# EAGLE design Photoresistor ADC (EAGLE 9.5.2)
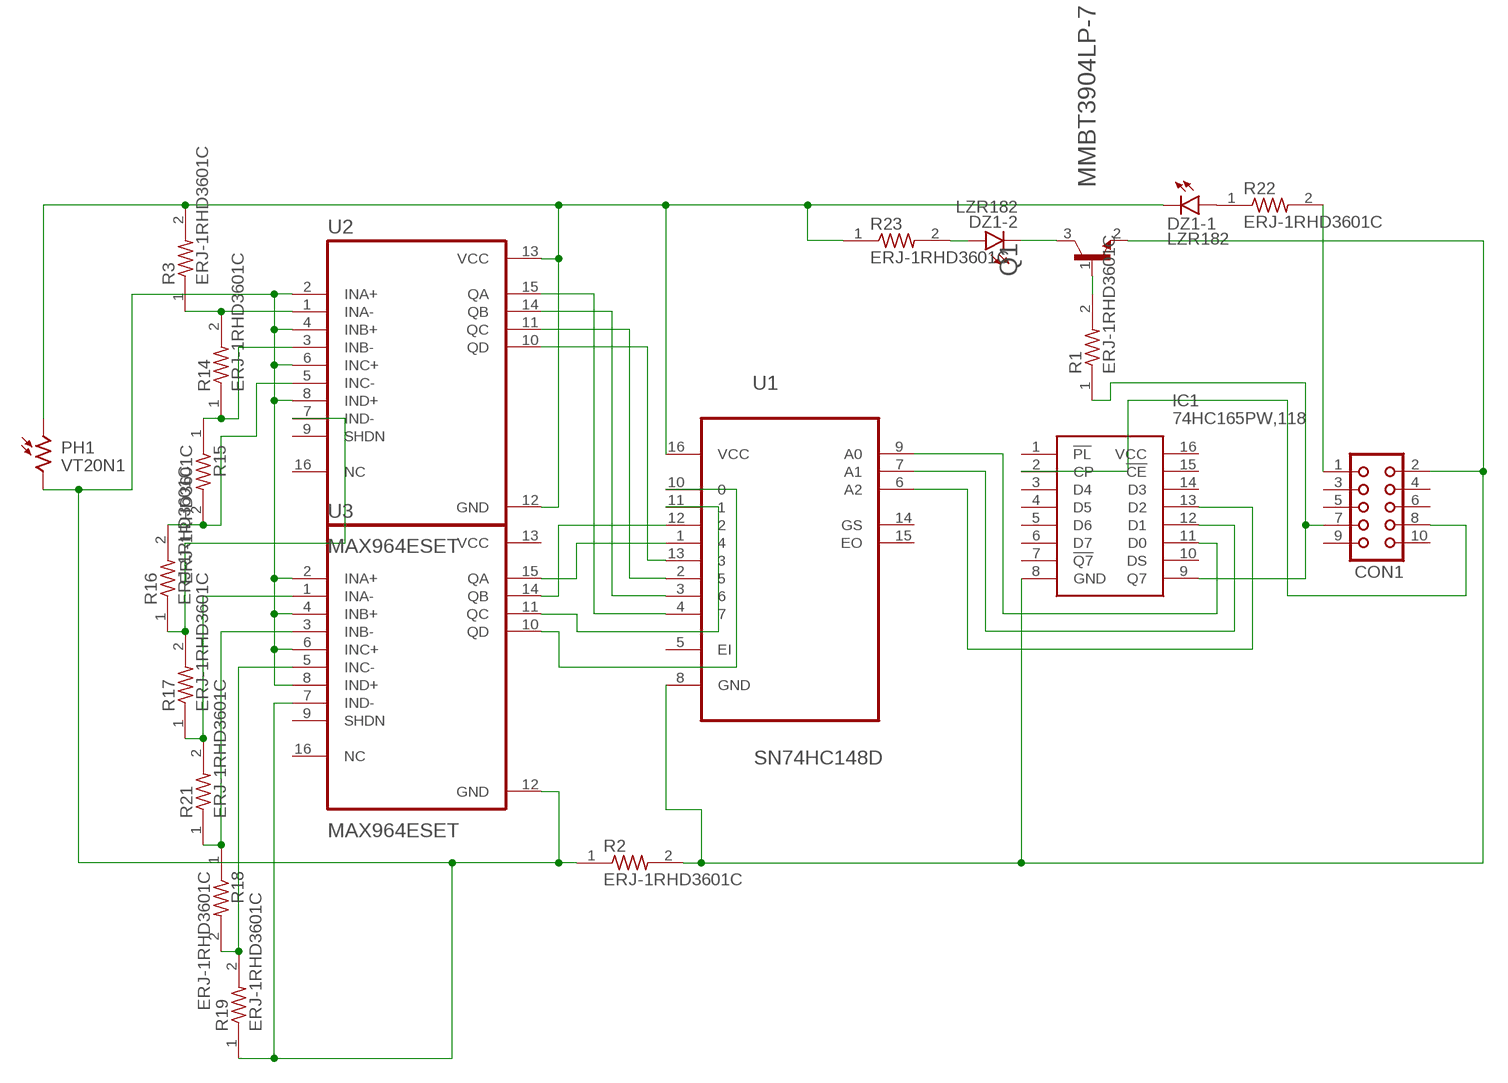
[diagram p0: schematic, sheet 1]

## Parts
CON1  CON10L  [CON10L]
DZ1  LZR182  [LZR182]
IC1  74HC165PW,118  [SOP65P640X110-16N]
PH1  VT20N1  [TO46-VT200]
Q1  MMBT3904LP-7  [DFN101X61X53-3N]
R1  ERJ-1RHD3601C  [RESC0603X26N]
R2  ERJ-1RHD3601C  [RESC0603X26N]
R3  ERJ-1RHD3601C  [RESC0603X26N]
R14  ERJ-1RHD3601C  [RESC0603X26N]
R15  ERJ-1RHD3601C  [RESC0603X26N]
R16  ERJ-1RHD3601C  [RESC0603X26N]
R17  ERJ-1RHD3601C  [RESC0603X26N]
R18  ERJ-1RHD3601C  [RESC0603X26N]
R19  ERJ-1RHD3601C  [RESC0603X26N]
R21  ERJ-1RHD3601C  [RESC0603X26N]
R22  ERJ-1RHD3601C  [RESC0603X26N]
R23  ERJ-1RHD3601C  [RESC0603X26N]
U1  SN74HC148D  [SOIC127P600X175-16N]
U2  MAX964ESET  [SOIC127P600X175-16N]
U3  MAX964ESET  [SOIC127P600X175-16N]

## Nets
N$1: Q1.1(B) R1.2
N$3: R15.2 R16.2 U2.5(INC-)
N$4: DZ1.A1(-1:A) R22.1
N$5: DZ1.K2(-2:C) Q1.3(C)
N$6: CON1.1 R22.2
N$7: CON1.7 IC1.9(Q7) R1.1
N$8: R3.1 R14.2 U2.1(INA-)
N$9: R14.1 R15.1 U2.3(INB-)
N$10: R16.1 R17.2 U2.7(IND-)
N$11: R17.1 R21.2 U3.1(INA-)
N$12: DZ1.K1(-1:C) PH1.1 R3.2 R23.1 U1.16(VCC) U2.12(GND) U2.13(VCC)
N$13: R18.1 R21.1 U3.3(INB-)
N$14: R18.2 R19.2 U3.5(INC-)
N$15: PH1.2 R2.1 R19.1 U2.2(INA+) U2.4(INB+) U2.6(INC+) U2.8(IND+) U3.2(INA+) U3.4(INB+) U3.6(INC+) U3.7(IND-) U3.8(IND+) U3.12(GND)
N$16: U1.4 U2.15(QA)
N$17: U1.3 U2.14(QB)
N$18: U1.2 U2.11(QC)
N$19: IC1.11(D0) U1.9(A0)
N$20: IC1.12(D1) U1.7(A1)
N$21: IC1.13(D2) U1.6(A2)
N$22: CON1.2 IC1.8(GND) Q1.2(E) R2.2 U1.8(GND)
N$23: U1.13 U2.10(QD)
N$24: CON1.8 IC1.2(CP)
N$25: DZ1.A2(-2:A) R23.2
N$26: U1.1 U3.15(QA)
N$27: U1.12 U3.14(QB)
N$28: U1.11 U3.11(QC)
N$29: U1.10 U3.10(QD)
Unconnected: CON1.3 CON1.4 CON1.5 CON1.6 CON1.9 CON1.10 IC1.1(!PL) IC1.3(D4) IC1.4(D5) IC1.5(D6) IC1.6(D7) IC1.7(!Q7) IC1.10(DS) IC1.14(D3) IC1.15(!CE) IC1.16(VCC) U1.5(EI) U1.14(GS) U1.15(EO) U2.9(SHDN) U2.16(NC) U3.9(SHDN) U3.16(NC)

## Power pins joined to a net without a drawn wire
VCC: U3.13(VCC)

## Library data of the parts
CON1 = con-harting:CON10L: CONNECTOR; OC_FARNELL: unknown; OC_NEWARK: unknown
DZ1 = led:LZR182: LED BLOCK 2 LEDs, Siemens
IC1 = 74HC165PW_118:74HC165PW,118: 74HC(T)165 - 8-bit parallel-in/serial-out shift register@en-us Source: Datasheet <https://assets.nexperia.com/documents/data-sheet/74HC_HCT165.pdf>; DESCRIPTION: 74HC(T)165 - 8-bit parallel-in/serial-out shift register@en-us; HEIGHT: 1.1mm; MANUFACTURER_NAME: Nexperia; MANUFACTURER_PART_NUMBER: 74HC165PW,118; MOUSER_PART_NUMBER: 771-74HC165PW-T; MOUSER_PRICE-STOCK: https://www.mouser.com/Search/Refine.aspx?Keyword=771-74HC165PW-T
PH1 = photo-elements:VT2*: Photoconductive Cell VT200 Series Source: http://optoelectronics.perkinelmer.com/content/Datasheets/DTS_vt200seriesdatasheet.pdf
Q1 = MMBT3904LP-7:MMBT3904LP-7: MMBT3904LP Series 40 V 200 mA NPN Surface Mount Transistor - DFN1006-3; DESCRIPTION: Bipolar _BJT_ Transistor NPN 40V 200mA 300MHz 250mW Surface Mount 3-DFN1006 _1.0x0.6_; DIGI-KEY_PART_NUMBER: MMBT3904LP-7DICT-ND; DIGI-KEY_PURCHASE_URL: https://www.digikey.com/product-detail/en/diodes-incorporated/MMBT3904LP-7/MMBT3904LP-7DICT-ND/8283872?utm_source=snapeda&utm_medium=aggregator&utm_campaign=symbol; MF: Diodes Inc.; MP: MMBT3904LP-7; PACKAGE: DFN-3 Diodes Inc.
R1-R3 R14-R19 R21-R23 = Resistor:ERJ-1RHD3601C: 0201 chip resistor 0201 SMD resistor 3600ohm 0.5%; AVAILABILITY: Unavailable; DESCRIPTION: 0201 chip resistor 0201 SMD resistor 3600ohm 0.5%; MF: Panasonic; MP: ERJ-1RHD3601C; PACKAGE: 0201 Panasonic; PRICE: None
U1 = SN74HC148D:SN74HC148D: 8:3 line Priority Encoder; AVAILABILITY: Unavailable; DESCRIPTION: IC 8-TO-3 PRIORITY ENCOD 16-SOIC; MF: Texas Instruments; MP: SN74HC148D; PACKAGE: SOIC-16 Texas Instruments; PRICE: None
U2 U3 = MAX964ESET:MAX964ESET; AVAILABILITY: Unavailable; DESCRIPTION: Linear IC - Comparator Maxim Integrated MAX964ESE+ Multi-purpose CMOS, TTL SOIC 16; MF: Maxim Integrated; MP: MAX964ESE+; PACKAGE: SOIC-16 Maxim; PRICE: None

## Board
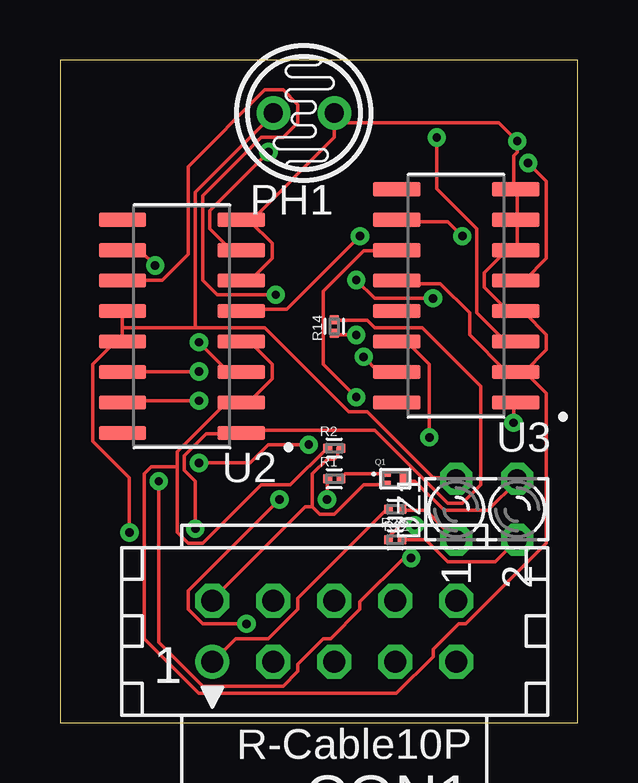
[diagram p1: board, top side]
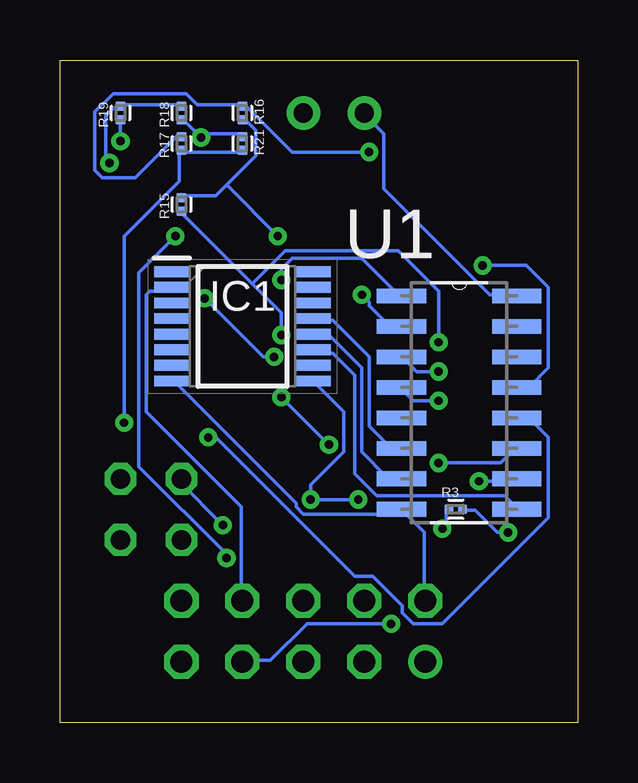
[diagram p2: board, bottom side, seen from below]

Size 21.57 x 27.61 mm. Coordinates in mm from the lower left corner, seen from the top.
Outline: 0,0 21.57,0 21.57,27.61 0,27.61 0,0
Copper layers (1*16): Top 0.035mm / dielectric 1.5mm / Bottom 0.035mm
Design rules "default": minimum track width 6mil, minimum drill 0.35mm, track to track 6mil, track to pad 6mil, pad to pad 6mil, via to via 6mil, smd to smd 6mil, copper to edge 40mil, drill to drill 6mil, minimum pad ring 10mil, minimum via ring 8mil, stop-mask expansion 4mil, vias tented up to drill 0mil, thermal gap 10mil

### Footprints (pad centres in the part's own frame; a part is rotated, then mirrored left to right if it is on the bottom)
CON10L = drill 0.914: 1 5.08,1.27 | drill 0.914 octagon: 2 5.08,-1.27; 3 2.54,1.27; 4 2.54,-1.27; 5 0,1.27; 6 0,-1.27; 7 -2.54,1.27; 8 -2.54,-1.27; 9 -5.08,1.27; 10 -5.08,-1.27
LZR182 = drill 0.813 octagon: A1 -1.27,1.27; A2 -1.27,-1.27; K1 1.27,1.27; K2 1.27,-1.27
SOP65P640X110-16N = smd 1.475 x 0.45: 1 -2.938,2.275; 2 -2.938,1.625; 3 -2.938,0.975; 4 -2.938,0.325; 5 -2.938,-0.325; 6 -2.938,-0.975; 7 -2.938,-1.625; 8 -2.938,-2.275; 9 2.938,-2.275; 10 2.938,-1.625; 11 2.938,-0.975; 12 2.938,-0.325; 13 2.938,0.325; 14 2.938,0.975; 15 2.938,1.625; 16 2.938,2.275
TO46-VT200 = drill 0.8 pad 1.4: 1 -1.27,0; 2 1.27,0
DFN101X61X53-3N = smd 0.28 x 0.17: 1 -0.325,0.175; 2 -0.325,-0.175 | smd 0.28 x 0.52: 3 0.325,0
RESC0603X26N = smd 0.38 x 0.4: 1 -0.28,0; 2 0.28,0
SOIC127P600X175-16N = smd 2.057 x 0.61: 1 -4.801,8.89; 2 -4.801,7.62; 3 -4.801,6.35; 4 -4.801,5.08; 5 -4.801,3.81; 6 -4.801,2.54; 7 -4.801,1.27; 8 -4.801,0; 9 0,0; 10 0,1.27; 11 0,2.54; 12 0,3.81; 13 0,5.08; 14 0,6.35; 15 0,7.62; 16 0,8.89
SOIC127P600X175-16N' = smd 1.97 x 0.59: 1 -2.475,4.445; 2 -2.475,3.175; 3 -2.475,1.905; 4 -2.475,0.635; 5 -2.475,-0.635; 6 -2.475,-1.905; 7 -2.475,-3.175; 8 -2.475,-4.445; 9 2.475,-4.445; 10 2.475,-3.175; 11 2.475,-1.905; 12 2.475,-0.635; 13 2.475,0.635; 14 2.475,1.905; 15 2.475,3.175; 16 2.475,4.445

### Placement (x,y rotation side)
CON1  11.43,3.81 180 top
DZ1  17.78,8.89 90 top
IC1  13.97,16.51 0 bottom
PH1  10.16,25.4 0 top
Q1  13.97,10.16 0 top
R1  11.43,10.16 0 top
R2  11.43,11.43 0 top
R3  5.08,8.89 0 bottom
R14  11.43,16.51 90 top
R15  16.51,21.59 90 bottom
R16  13.97,25.4 270 bottom
R17  16.51,24.13 90 bottom
R18  16.51,25.4 90 bottom
R19  19.05,25.4 90 bottom
R21  13.97,24.13 270 bottom
R22  13.97,8.89 180 top
R23  13.97,7.62 0 top
U1  2.54,8.89 0 bottom
U2  MAX964ESET  [SOIC127P600X175-16N']  5.08,16.51 180 top
U3  MAX964ESET  [SOIC127P600X175-16N']  16.51,17.78 180 top

### Tracks (layer width: path | path; a pad name or v marks a point on that pad's centre or on a via)
N$1
  Top 0.152: Q1.1 13.56,10.36 11.89,10.36 11.73,10.21 R1.2
N$3  (via drill 0.35)
  Top 0.152: v12.5,20.27 9.45,17.22 7.62,17.22 U2.5
  Bottom 0.152: 14.63,22.4 15.09,21.95 16.46,21.95 R15.2 | 14.63,22.4 13.41,23.62 13.41,24.69 13.72,24.99 13.87,24.99 R16.2 | 14.63,22.4 v12.5,20.27
N$4
  Top 0.152: R22.1 14.33,8.84 15.24,8.84 16.46,7.62 DZ1.A1
N$5
  Top 0.152: Q1.3 14.33,10.06 14.78,10.06 16,8.84 17.83,8.84 19.05,10.06 DZ1.K2
N$6
  Top 0.152: CON1.1 7.32,3.5 8.69,3.5 9.91,4.72 9.91,5.18 13.56,8.84 R22.2
N$7  (via drill 0.35)
  Top 0.152: v11.12,9.3 11.12,10.06 R1.1 | v7.77,4.12 5.94,4.12 5.33,4.72 5.33,5.49 v9.14,9.3
  Bottom 0.152: IC1.9 10.97,14.17 9.75,12.95 9.75,11.28 11.12,9.91 v11.12,9.3 v9.14,9.3 | v7.77,4.12 11.28,4.12 12.8,2.59 13.87,2.59 CON1.7
N$8  (via drill 0.35)
  Top 0.152: v5.64,8.08 5.64,10.06 5.18,10.52 5.18,11.12 6.1,12.04 7.47,12.04 U2.1 7.62,12.19 13.11,12.19 16.15,9.14 16.76,9.14 17.53,9.91 17.53,14.02 15.09,16.46 13.11,16.46 12.8,16.76 11.43,16.76 R14.2
  Bottom 0.152: v5.64,8.08 5.49,8.23 5.49,8.84 R3.1
N$9  (via drill 0.35)
  Top 0.152: v12.34,16.15 11.43,16.15 R14.1 | v5.79,15.85 7.01,14.63 7.47,14.63 U2.3
  Bottom 0.152: v12.34,16.15 12.34,17.07 13.56,18.29 | 13.56,18.29 16.46,21.18 R15.1 | v5.79,15.85 5.79,17.98 7.47,19.66 12.19,19.66 13.56,18.29
N$10  (via drill 0.35)
  Top 0.152: v8.69,23.77 6.25,21.34 6.25,20.57 7.01,19.81 7.47,19.81 U2.7
  Bottom 0.152: R17.2 16.61,24.54 18.44,22.71 19.81,22.71 20.12,23.01 20.12,25.45 19.36,26.21 16.31,26.21 15.85,25.76 14.02,25.76 R16.1 13.87,25.76 11.89,23.77 v8.69,23.77
N$11  (via drill 0.35)
  Top 0.152: v18.9,12.5 18.9,13.26 U3.1
  Bottom 0.152: R21.2 14.02,23.77 16.46,23.77 R17.1 16.61,23.77 16.61,22.55 18.9,20.27 v18.9,12.5
N$12  (via drill 0.35)
  Top 0.152: 2.59,16.46 2.59,17.07 U2.12 | 2.59,16.46 2.59,16.15 | 2.59,16.15 2.59,16 U2.13 2.59,16.15 | v14.78,8.23 14.17,8.23 13.72,7.77 13.72,7.62 R23.1 | v2.9,7.92 2.9,10.21 1.37,11.73 1.37,14.94 2.59,16.15 | 2.59,16.46 5.64,16.46 | 5.64,16.46 8.53,16.46 12.04,12.95 12.8,12.95 15.54,10.21 16.46,10.21 DZ1.K1 | 5.64,16.46 5.64,22.1 8.84,25.3 PH1.1
  Bottom 0.152: U1.16 2.59,17.83 3.66,17.83 8.08,22.25 8.08,24.54 8.84,25.3 PH1.1 | v14.78,8.23 16.61,10.06 DZ1.K1 | v2.9,7.92 3.35,7.92 4.27,8.84 4.72,8.84 R3.2
N$13  (via drill 0.35)
  Top 0.152: v15.7,24.38 15.7,22.25 17.37,20.57 17.37,17.07 18.44,16 18.9,16 U3.3
  Bottom 0.152: 15.7,24.54 15.85,24.54 16.46,25.15 R18.1 | 15.7,24.54 14.02,24.54 R21.1 | v15.7,24.38 15.7,24.54
N$14  (via drill 0.35)
  Top 0.152: v19.51,23.32 20.27,22.55 20.27,19.36 19.36,18.44 19.05,18.44 U3.5
  Bottom 0.152: R18.2 16.61,25.76 19.05,25.76 R19.2 19.05,25.6 19.36,25.6 19.66,25.3 19.66,23.47 v19.51,23.32
N$15  (via drill 0.35)
  Top 0.152: 7.92,20.88 8.84,19.96 8.84,19.36 7.92,18.44 7.62,18.44 U2.6 | 7.92,20.88 7.62,20.88 U2.8 7.92,20.88 | 11.43,24.99 11.43,24.38 7.92,20.88 | 11.43,24.99 PH1.2 11.43,25.3 | 4.88,10.67 4.88,11.28 6.86,13.26 7.47,13.26 U2.2 7.62,13.41 7.92,13.41 8.84,14.33 8.84,14.94 7.92,15.85 7.62,15.85 U2.4 | 4.88,10.67 4.88,7.92 5.33,7.47 5.94,7.47 8.38,9.91 9.6,9.91 11.12,11.43 R2.1 | 19.36,14.63 19.05,14.63 U3.2 | 19.36,14.63 20.27,15.54 20.27,16.15 19.36,17.07 19.05,17.07 U3.4 18.9,17.22 18.59,17.22 17.68,18.14 17.68,18.75 18.59,19.66 18.9,19.66 U3.6 19.05,19.81 19.05,20.88 U3.7 19.05,21.03 19.05,22.1 U3.8 18.9,22.25 18.9,23.62 19.05,23.77 v19.05,24.23 18.29,24.99 11.43,24.99 | U3.12 14.17,18.29 15.85,18.29 17.07,17.07 17.07,16.15 18.59,14.63 18.9,14.63 U3.2 | 4.88,10.67 3.81,10.67 3.5,10.36 3.5,3.5 5.79,1.22 14.02,1.22 15.54,2.74 15.54,3.05 16.61,4.12 16.92,4.12 20.27,7.47 20.27,13.72 19.36,14.63 | 19.36,14.63 U3.2
  Bottom 0.152: v19.05,24.23 R19.1
N$16  (via drill 0.35)
  Top 0.152: v5.79,13.41 2.74,13.41 U2.15
  Bottom 0.152: v5.79,13.41 6.86,13.41 7.32,13.87 U1.4
N$17  (via drill 0.35)
  Top 0.152: v5.79,14.63 2.74,14.63 U2.14
  Bottom 0.152: v5.79,14.63 6.71,14.63 7.32,15.24 U1.3
N$18  (via drill 0.35)
  Top 0.152: v8.99,17.83 6.55,17.83 5.94,18.44 5.94,21.95 8.38,24.38 9.3,24.38 9.91,24.99 9.91,25.76 9.3,26.36 8.53,26.36 5.33,23.16 5.33,19.51 4.27,18.44 2.74,18.44 U2.11
  Bottom 0.152: v8.99,17.83 8.69,17.53 8.69,17.37 7.92,16.61 7.47,16.61 U1.2
N$19
  Bottom 0.152: IC1.11 10.97,15.39 10.21,15.39 9.3,14.48 9.3,10.36 8.38,9.45 3.05,9.45 2.59,8.99 U1.9
N$20
  Bottom 0.152: IC1.12 10.97,16.15 10.36,16.15 8.99,14.78 8.99,11.28 7.92,10.21 7.47,10.21 U1.7
N$21
  Bottom 0.152: U1.6 7.77,11.43 8.69,12.34 8.69,15.24 10.21,16.76 10.97,16.76 IC1.13
N$22
  Top 0.152: 10.52,8.99 10.82,8.69 11.43,8.69 12.65,9.91 13.56,9.91 Q1.2 | 10.52,8.99 10.52,10.36 11.12,10.97 11.43,10.97 11.58,11.12 11.58,11.43 R2.2 | 10.52,8.99 10.21,8.99 6.4,5.18 CON1.2
  Bottom 0.152: IC1.8 16.76,14.17 11.73,9.14 11.73,8.99 11.43,8.69 7.62,8.69 7.47,8.84 U1.8 7.32,8.84 6.4,7.92 6.4,5.18 CON1.2
N$23  (via drill 0.35)
  Top 0.152: v3.96,19.05 3.35,19.66 2.74,19.66 U2.10
  Bottom 0.152: v3.96,19.05 2.13,19.05 1.22,18.14 1.22,14.78 1.98,14.02 2.44,14.02 U1.13
N$24
  Bottom 0.152: IC1.2 16.92,17.98 17.83,17.98 17.98,17.83 17.98,12.95 14.02,8.99 14.02,5.18 CON1.8
N$25
  Top 0.152: R23.2 15.24,7.62 16.15,6.71 18.14,6.71 DZ1.A2
N$26  (via drill 0.35)
  Top 0.152: v12.65,15.24 13.26,14.63 14.02,14.63 U3.15 | v15.54,17.68 13.11,17.68 v12.34,18.44
  Bottom 0.152: v12.65,15.24 13.11,15.24 v15.54,17.68 | v12.34,18.44 12.34,18.9 11.89,19.36 8.99,19.36 7.47,17.83 U1.1
N$27  (via drill 0.35)
  Top 0.152: v15.39,11.89 15.39,14.94 14.48,15.85 14.17,15.85 U3.14
  Bottom 0.152: v15.39,11.89 15.09,11.89 9.3,6.1 8.53,6.1 7.32,4.88 7.32,4.57 6.86,4.12 5.64,4.12 1.22,8.53 1.22,11.89 1.98,12.65 2.44,12.65 U1.12
N$28  (via drill 0.35)
  Top 0.152: v12.34,13.56 10.97,14.94 10.97,17.98 12.65,19.66 14.02,19.66 U3.11 | v10.36,11.58 8.69,11.58 7.92,10.82 v5.79,10.82
  Bottom 0.152: v10.36,11.58 v12.34,13.56 | v5.79,10.82 3.2,10.82 2.59,11.43 U1.11
N$29  (via drill 0.35)
  Top 0.152: v16.76,20.27 16.15,20.88 14.17,20.88 U3.10 | v14.63,6.86 14.33,6.86 12.5,5.03 12.5,4.72 11.28,3.5 10.97,3.5 9.91,2.44 9.91,2.13 9.3,1.52 5.94,1.52 4.12,3.35 v4.12,10.06
  Bottom 0.152: v16.76,20.27 18.29,18.75 18.29,10.67 14.63,7.01 v14.63,6.86 | v4.12,10.06 2.59,10.06 U1.10